# Altium project RP2040开发板.PrjPcb
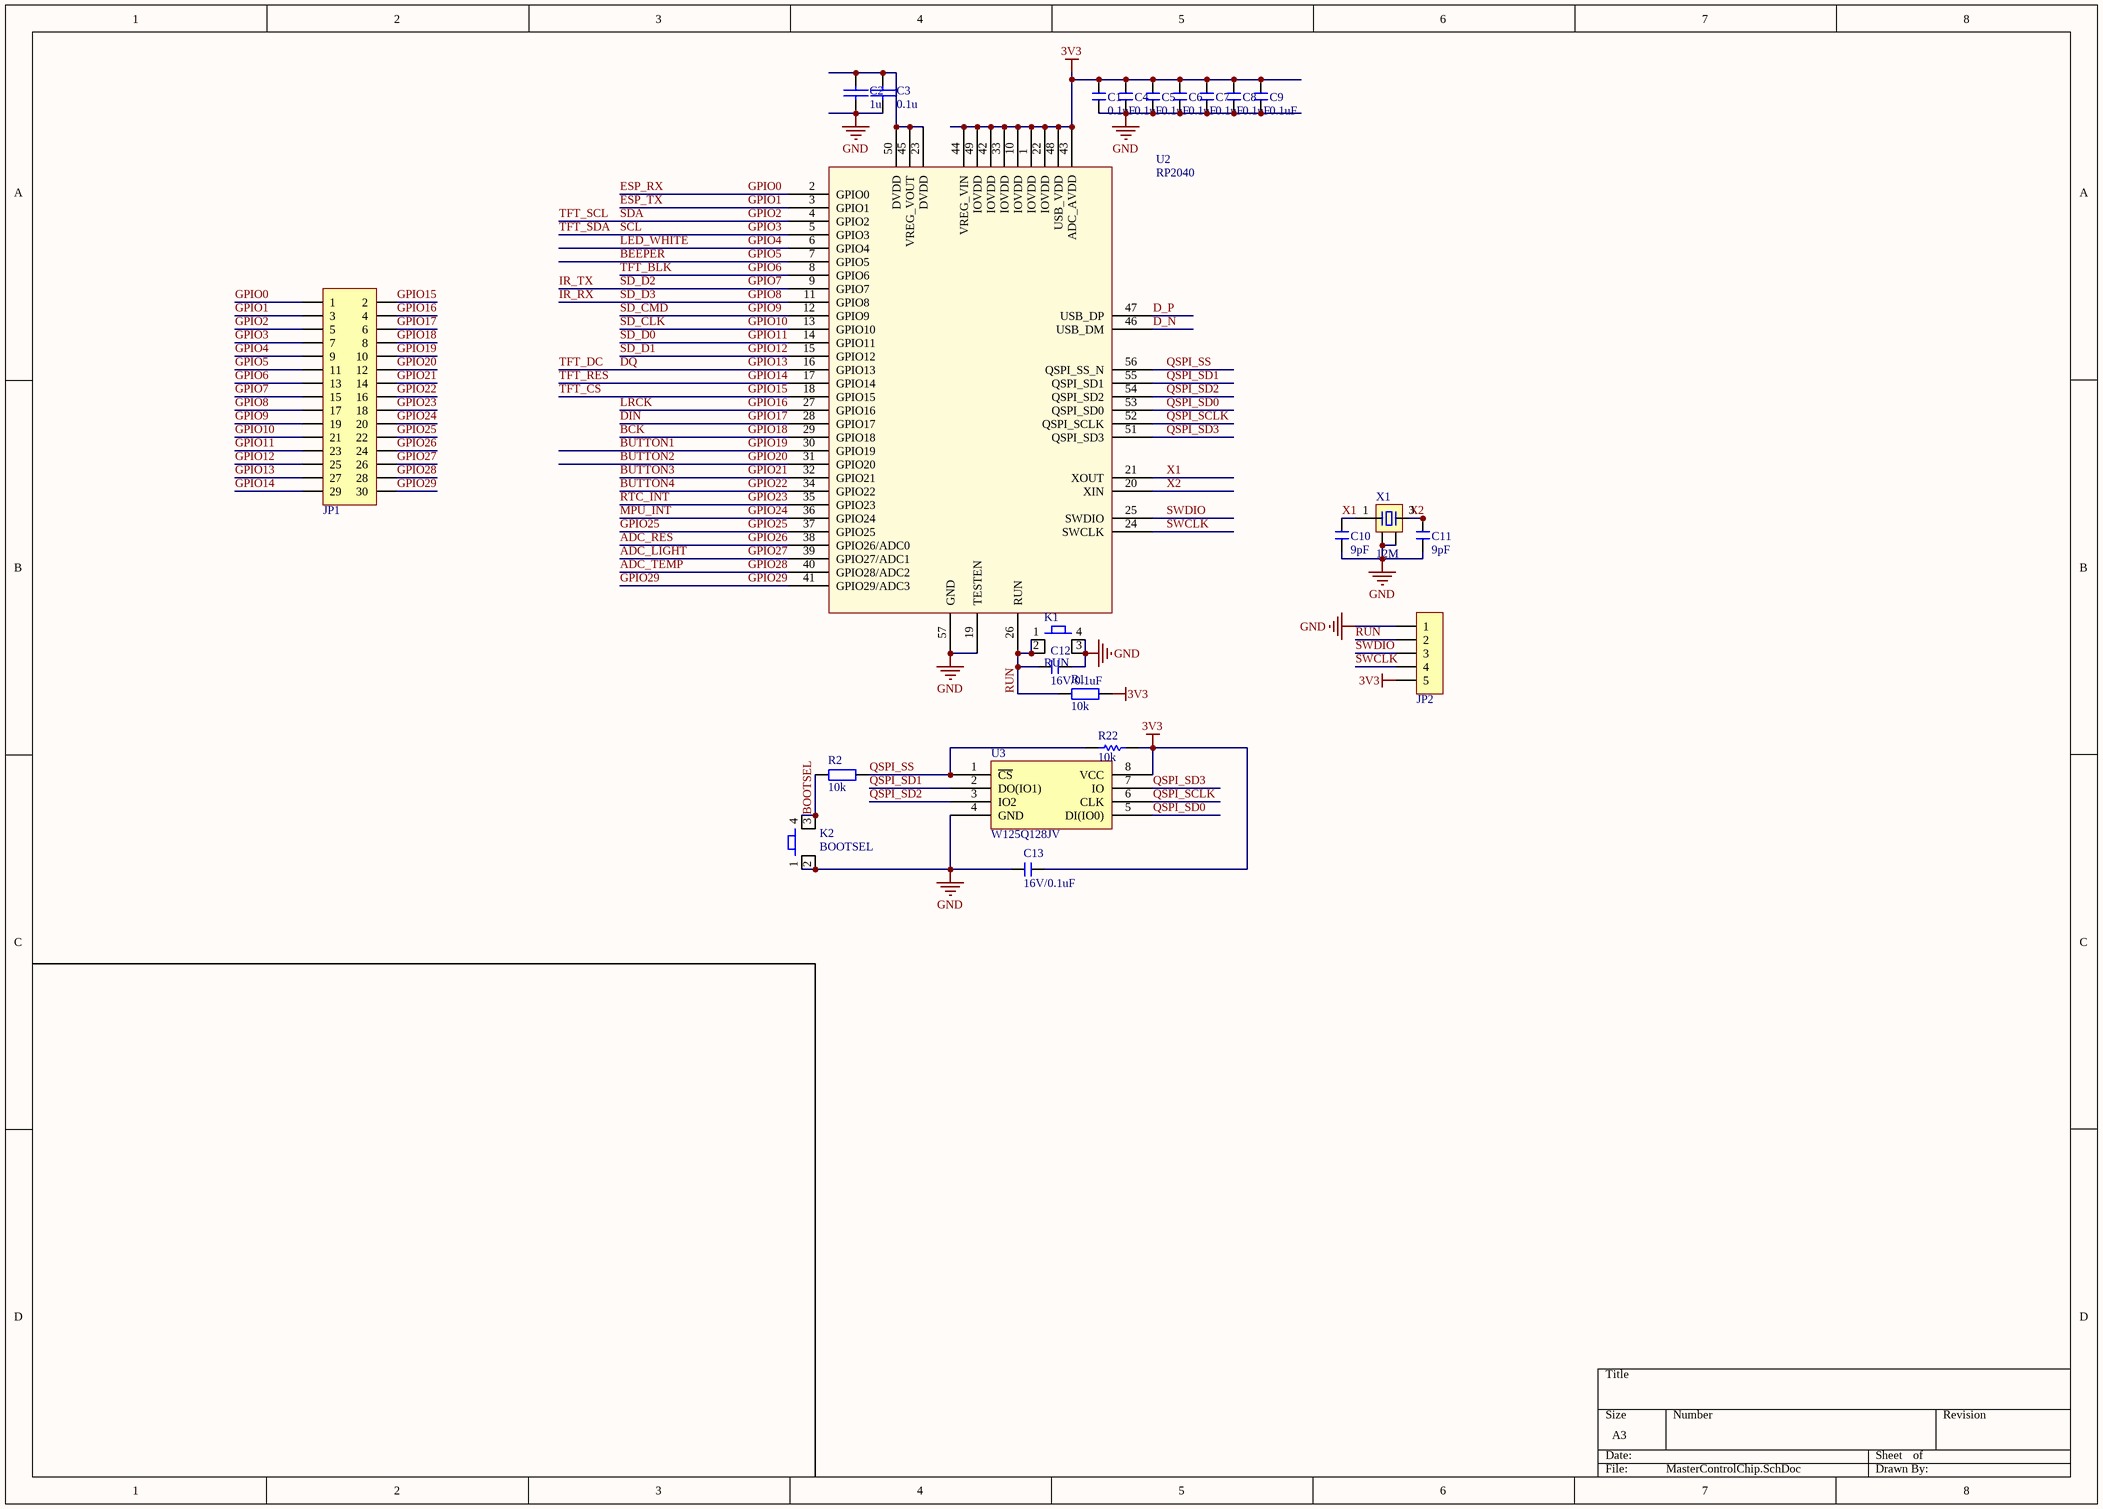
[diagram p0: MasterControlChip.SchDoc]
3 sheets, 139 parts. Net scope: global (net labels, ports and power ports of the same name join across sheets).
Board file: PCB2.PcbDoc
Sheets:
  MasterControlChip.SchDoc
  PowerManager.SchDoc
  Peripheral.SchDoc

## Sheet MasterControlChip.SchDoc
size A3

### Parts
C1  0.1uF  [C 0603_L]
C2  1u  [C 0603_L]
C3  0.1u  [C 0603_L]
C4  0.1uF  [C 0603_L]
C5  0.1uF  [C 0603_L]
C6  0.1uF  [C 0603_L]
C7  0.1uF  [C 0603_L]
C8  0.1uF  [C 0603_L]
C9  0.1uF  [C 0603_L]
C10  9pF  [C 0603_L]
C11  9pF  [C 0603_L]
C12  16V/0.1uF  [C 0603_L]
C13  16V/0.1uF  [C 0603_L]
JP1  Header 2X11  [HDR2.54-LI-2x15P]  (value not drawn)
JP2  HDR-1X5  [HDR2.54-M-LI-5P]  (value not drawn)
K1  RUN  [四角贴片开关]
K2  BOOTSEL  [四角贴片开关]
R1  10k  [R 0603_L]
R2  10k  [R 0603_L]
R22  10k  [0603R]
U2  RP2040  [QFN-56]
U3  W125Q128JV  [SOIC-8-208mil]
X1  12M  [OSC 3225-4P]

### Nets
3V3: C1.2 C4.2 C5.2 C6.2 C7.2 C8.2 C9.2 C13.1 JP2.5 R1.1 R22.2 U2.1(IOVDD) U2.10(IOVDD) U2.22(IOVDD) U2.33(IOVDD) U2.42(IOVDD) U2.43(ADC_AVDD) U2.44(VREG_VIN) U2.48(USB_VDD) U2.49(IOVDD) U3.8(VCC)
GND: C1.1 C2.1 C3.1 C4.1 C5.1 C6.1 C7.1 C8.1 C9.1 C10.1 C11.1 C12.1 C13.2 JP2.1 K1.3 K1.4 K2.1 K2.2 U2.19(TESTEN) U2.57(GND) U3.4(GND) X1.2 X1.4
ADC_LIGHT: JP1.26 U2.39(GPIO27/ADC1)  [also labelled GPIO27]
ADC_RES: JP1.24 U2.38(GPIO26/ADC0)  [also labelled GPIO26]
ADC_TEMP: JP1.28 U2.40(GPIO28/ADC2)  [also labelled GPIO28]
BCK: JP1.8 U2.29(GPIO18)  [also labelled GPIO18]
BEEPER: JP1.11 U2.7(GPIO5)  [also labelled GPIO5]
BOOTSEL: K2.3 K2.4 R2.2
BUTTON1: JP1.10 U2.30(GPIO19)  [also labelled GPIO19]
BUTTON2: JP1.12 U2.31(GPIO20)  [also labelled GPIO20]
BUTTON3: JP1.14 U2.32(GPIO21)  [also labelled GPIO21]
BUTTON4: JP1.16 U2.34(GPIO22)  [also labelled GPIO22]
D_N: U2.46(USB_DM)
D_P: U2.47(USB_DP)
DIN: JP1.6 U2.28(GPIO17)  [also labelled GPIO17]
DQ: JP1.27 U2.16(GPIO13)  [also labelled GPIO13, TFT_DC]
ESP_RX: JP1.1 U2.2(GPIO0)  [also labelled GPIO0]
ESP_TX: JP1.3 U2.3(GPIO1)  [also labelled GPIO1]
GPIO2: JP1.5 U2.4(GPIO2)  [also labelled SDA, TFT_SCL]
GPIO3: JP1.7 U2.5(GPIO3)  [also labelled SCL, TFT_SDA]
GPIO4: JP1.9 U2.6(GPIO4)  [also labelled LED_WHITE]
GPIO6: JP1.13 U2.8(GPIO6)  [also labelled TFT_BLK]
GPIO7: JP1.15 U2.9(GPIO7)  [also labelled IR_TX, SD_D2]
GPIO8: JP1.17 U2.11(GPIO8)  [also labelled IR_RX, SD_D3]
GPIO9: JP1.19 U2.12(GPIO9)  [also labelled SD_CMD]
GPIO10: JP1.21 U2.13(GPIO10)  [also labelled SD_CLK]
GPIO11: JP1.23 U2.14(GPIO11)  [also labelled SD_D0]
GPIO12: JP1.25 U2.15(GPIO12)  [also labelled SD_D1]
GPIO14: JP1.29 U2.17(GPIO14)  [also labelled TFT_RES]
GPIO15: JP1.2 U2.18(GPIO15)  [also labelled TFT_CS]
GPIO16: JP1.4 U2.27(GPIO16)  [also labelled LRCK]
GPIO23: JP1.18 U2.35(GPIO23)  [also labelled RTC_INT]
GPIO24: JP1.20 U2.36(GPIO24)  [also labelled MPU_INT]
GPIO25: JP1.22 U2.37(GPIO25)
GPIO29: JP1.30 U2.41(GPIO29/ADC3)
QSPI_SCLK: U2.52(QSPI_SCLK) U3.6(CLK)
QSPI_SD0: U2.53(QSPI_SD0) U3.5(DI(IO0))
QSPI_SD1: U2.55(QSPI_SD1) U3.2(DO(IO1))
QSPI_SD2: U2.54(QSPI_SD2) U3.3(IO2)
QSPI_SD3: U2.51(QSPI_SD3) U3.7(IO)
QSPI_SS: R2.1 R22.1 U2.56(QSPI_SS_N) U3.1(~{CS})
RUN: C12.2 JP2.2 K1.1 K1.2 R1.2 U2.26(RUN)
SWCLK: JP2.4 U2.24(SWCLK)
SWDIO: JP2.3 U2.25(SWDIO)
X1: C10.2 U2.21(XOUT) X1.1
X2: C11.2 U2.20(XIN) X1.3
NetC2_2: C2.2 C3.2 U2.23(DVDD) U2.45(VREG_VOUT) U2.50(DVDD)

### Library data of the parts
C1 C4-C13 = C: 无极性贴片电容; 版权归属: 源创客; 材质: X7R; BOM名称: 无极性贴片电容; 学习资源: www.ooocke.com
C2 = CAP: 靠近RP2040
C3 = CAP: 无极性电容
JP1 = Header 15X2: 15*2P接插件; 版权归属: 源创客; BOM名称: 15*2P接插件; 学习资源: www.ooocke.com
JP2 = Header 5: 5P接插件; 版权归属: 源创客; BOM名称: 5P接插件; 学习资源: www.ooocke.com
K1 K2 = 四角轻触开关
R1 R2 = R: 贴片电阻; 版权归属: 源创客; BOM名称: 贴片电阻; 学习资源: www.ooocke.com
R22 = RES
X1 = XTAL-4P: 4脚无源晶振

## Sheet PowerManager.SchDoc
size A4
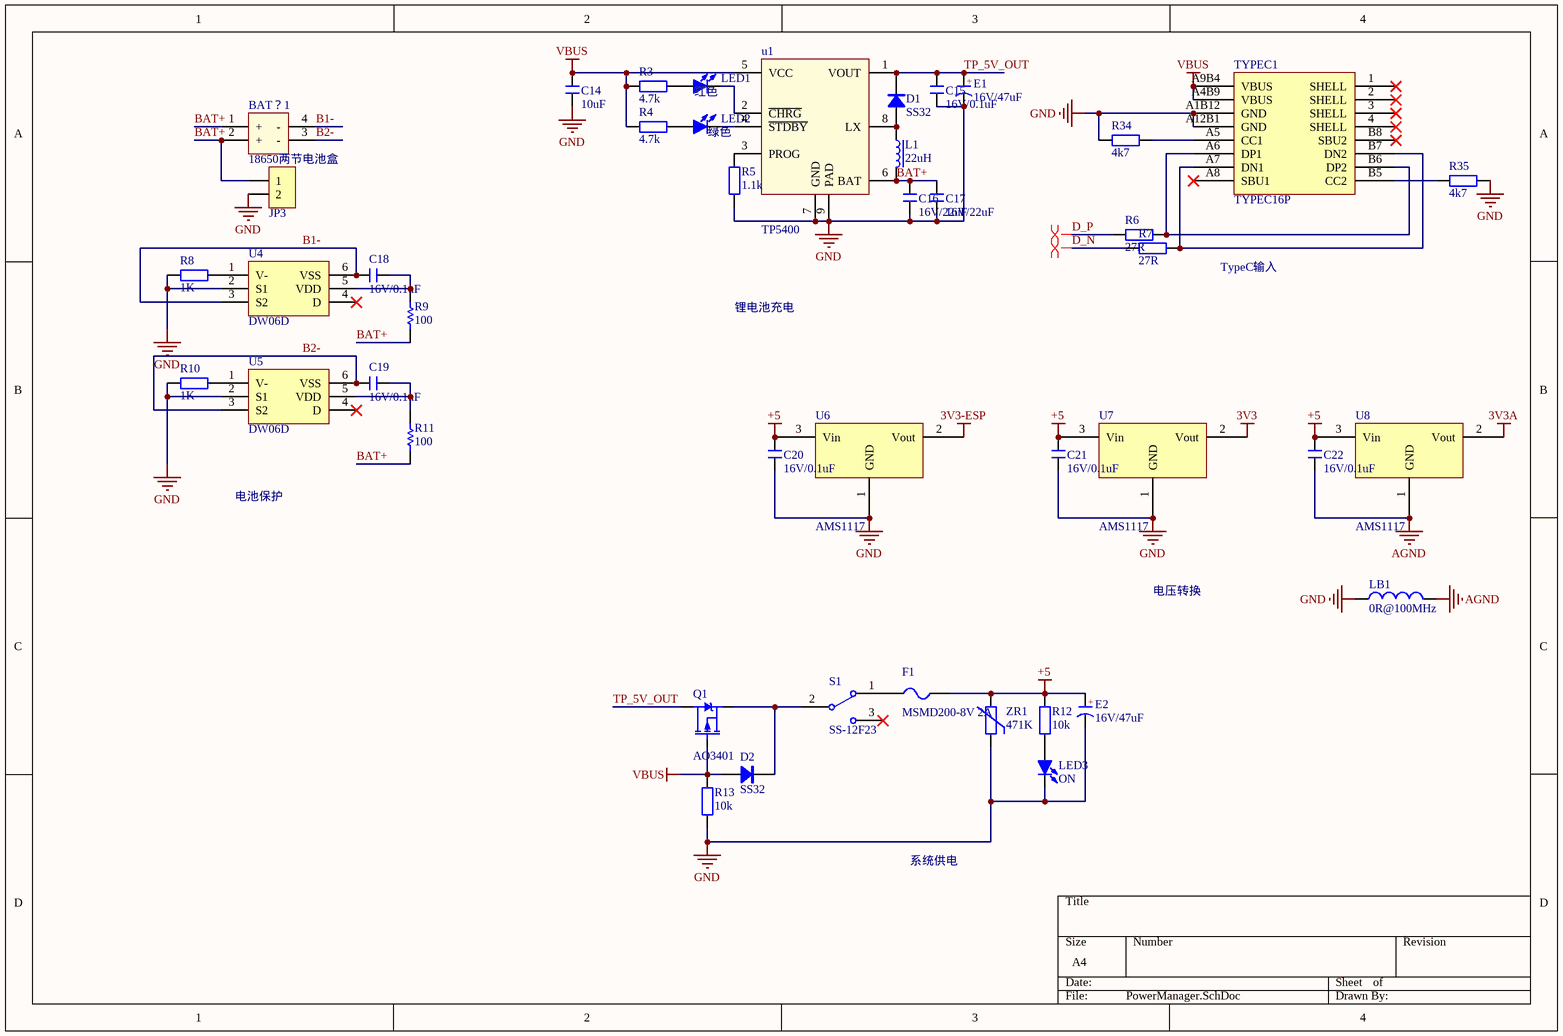
[diagram p1: PowerManager.SchDoc]

### Parts
BAT？1  18650两节电池盒  [18650两节电池盒]
C14  10uF  [C 0603_L]
C15  16V/0.1uF  [C 1206_L]
C16  16V/22uF  [C 1206_L]
C17  16V/22uF  [C 1206_L]
C18  16V/0.1uF  [C 1206_L]
C19  16V/0.1uF  [C 1206_L]
C20  16V/0.1uF  [C 1206_L]
C21  16V/0.1uF  [C 1206_L]
C22  16V/0.1uF  [C 1206_L]
D1  SS32  [SMA]
D2  SS32  [SMA]
E1  16V/47uF  [CM C(5*5.4)]
E2  16V/47uF  [CM C(5*5.4)]
F1  MSMD200-8V 2A  [FU 1206]
JP3  HDR-1X2  [XH2.54-WS-2P]  (value not drawn)
L1  22uH  [NR4020]
LB1  0R@100MHz  [FB 1206_L]
LED1  红色  [LED 0603R]
LED2  绿色  [LED 0603G]
LED3  ON  [LED 0603R]
Q1  AO3401  [SOT23]
R3  4.7k  [R 0603_L]
R4  4.7k  [R 0603_L]
R5  1.1k  [R 0603_L]
R6  27R  [R 0603_L]
R7  27R  [R 0603_L]
R8  1K  [R 0603_L]
R9  100  [0603R]
R10  1K  [R 0603_L]
R11  100  [0603R]
R12  10k  [R 0603_L]
R13  10k  [R 0603_L]
R34  4k7  [R 0603_L]
R35  4k7  [R 0603_L]
S1  SS-12F23  [SK-12D07VG3]
TYPEC1  TYPEC16P  [TYPEC-16P]
u1  TP5400  [ESOP8]
U4  DW06D  [SOT23-6]
U5  DW06D  [SOT23-6]
U6  AMS1117  [SOT89]
U7  AMS1117  [SOT89]
U8  AMS1117  [SOT89]
ZR1  471K  [R 0603_L]

### Nets
3V3: U7.2(Vout)
3V3-ESP: U6.2(Vout)
3V3A: U8.2(Vout)
+5: C20.2 C21.2 C22.2 E2.1(A) F1.2 R12.2 U6.3(Vin) U7.3(Vin) U8.3(Vin) ZR1.2
AGND: C22.1 LB1.2 U8.1(GND)
GND: C14.1 C15.1 C16.1 C17.1 C20.1 C21.1 E1.2(K) E2.2(K) JP3.2 LB1.1 LED3.2(K) R5.1 R8.1 R10.1 R13.1 R34.1 R35.1 TYPEC1.A1B12(GND) TYPEC1.A12B1(GND) u1.7(GND) u1.9(PAD) U4.2(S1) U5.2(S1) U6.1(GND) U7.1(GND) ZR1.1
VBUS: C14.2 D2.1(A) Q1.G R3.2 R4.2 R13.2 TYPEC1.A4B9(VBUS) TYPEC1.A9B4(VBUS) u1.5(VCC)
B1-: BAT？1.4(-) C18.2 U4.3(S2) U4.6(VSS)
B2-: BAT？1.3(-) C19.2 U5.3(S2) U5.6(VSS)
BAT+: BAT？1.1(+) BAT？1.2(+) C16.2 C17.2 JP3.1 L1.2 R9.2 R11.2 u1.6(BAT)
D_N: R7.1
D_P: R6.1
TP_5V_OUT: C15.2 D1.2(K) E1.1(A) Q1.D u1.1(VOUT)
NetC18_1: C18.1 R9.1 U4.5(VDD)
NetC19_1: C19.1 R11.1 U5.5(VDD)
NetD1_1: D1.1(A) L1.1 u1.8(LX)
NetD2_2: D2.2(K) Q1.S S1.2
NetF1_1: F1.1 S1.1
NetLED1_1: LED1.1(A) R3.1
NetLED1_2: LED1.2(K) u1.2(~{CHRG})
NetLED2_1: LED2.1(A) R4.1
NetLED2_2: LED2.2(K) u1.4(~{STDBY})
NetLED3_1: LED3.1(A) R12.1
NetR5_2: R5.2 u1.3(PROG)
NetR6_2: R6.2 TYPEC1.A6(DP1) TYPEC1.B6(DP2)
NetR7_2: R7.2 TYPEC1.A7(DN1) TYPEC1.B7(DN2)
NetR8_2: R8.2 U4.1(V-)
NetR10_2: R10.2 U5.1(V-)
NetR34_2: R34.2 TYPEC1.A5(CC1)
NetR35_2: R35.2 TYPEC1.B5(CC2)

Not connected (* = marked no-connect by the designer): S1 3*; TYPEC1 1(SHELL)* 2(SHELL)* 3(SHELL)* 4(SHELL)* A8(SBU1)* B8(SBU2)*; U4 4(D)*; U5 4(D)*

### Layout directives
differential pair: D_N, D_P

### Notes on the sheet
- 锂电池充电
- TypeC输入
- 电池保护
- 电压转换
- 系统供电
- (in symbol C-CM) +

### Library data of the parts
C14-C22 = C: 无极性贴片电容; 版权归属: 源创客; 材质: X7R; BOM名称: 无极性贴片电容; 学习资源: www.ooocke.com
D1 D2 = SS210: 肖特基二极管; 版权归属: 源创客; BOM名称: 肖特基二极管; 学习资源: www.ooocke.com
E1 E2 = C-CM: 贴片电解电容; 版权归属: 源创客; BOM名称: 贴片电解电容; 学习资源: www.ooocke.com
F1 = FU: 贴片保险丝; 版权归属: 源创客; BOM名称: 贴片保险丝; 学习资源: www.ooocke.com
JP3 = Header 2: 2P接插件; 版权归属: 源创客; BOM名称: 2P接插件; 学习资源: www.ooocke.com
L1 = L-NR: NR磁胶电感; 版权归属: 源创客; BOM名称: NR磁胶电感; 学习资源: www.ooocke.com
LB1 = LB: 磁珠; 版权归属: 源创客; BOM名称: 磁珠; 学习资源: www.ooocke.com
LED1-LED3 = LED-SMD: 贴片LED; 版权归属: 源创客; BOM名称: 贴片LED; 学习资源: www.ooocke.com
Q1 = P-MOS: P沟道场效应管
R3-R8 R10 R12 R13 R34 R35 = R: 贴片电阻; 版权归属: 源创客; BOM名称: 贴片电阻; 学习资源: www.ooocke.com
R9 R11 = RES
S1 = SSW-1P: 1路波动开关; BOM名称: 波动开关; 版权归属: 源创客; 学习资源: www.ooocke.com
U6-U8 = AMS1117: 三端稳压芯片
ZR1 = R_VDR: 压敏电阻; 版权归属: 源创客; BOM名称: 压敏电阻; 学习资源: www.ooocke.com

## Sheet Peripheral.SchDoc
size A3
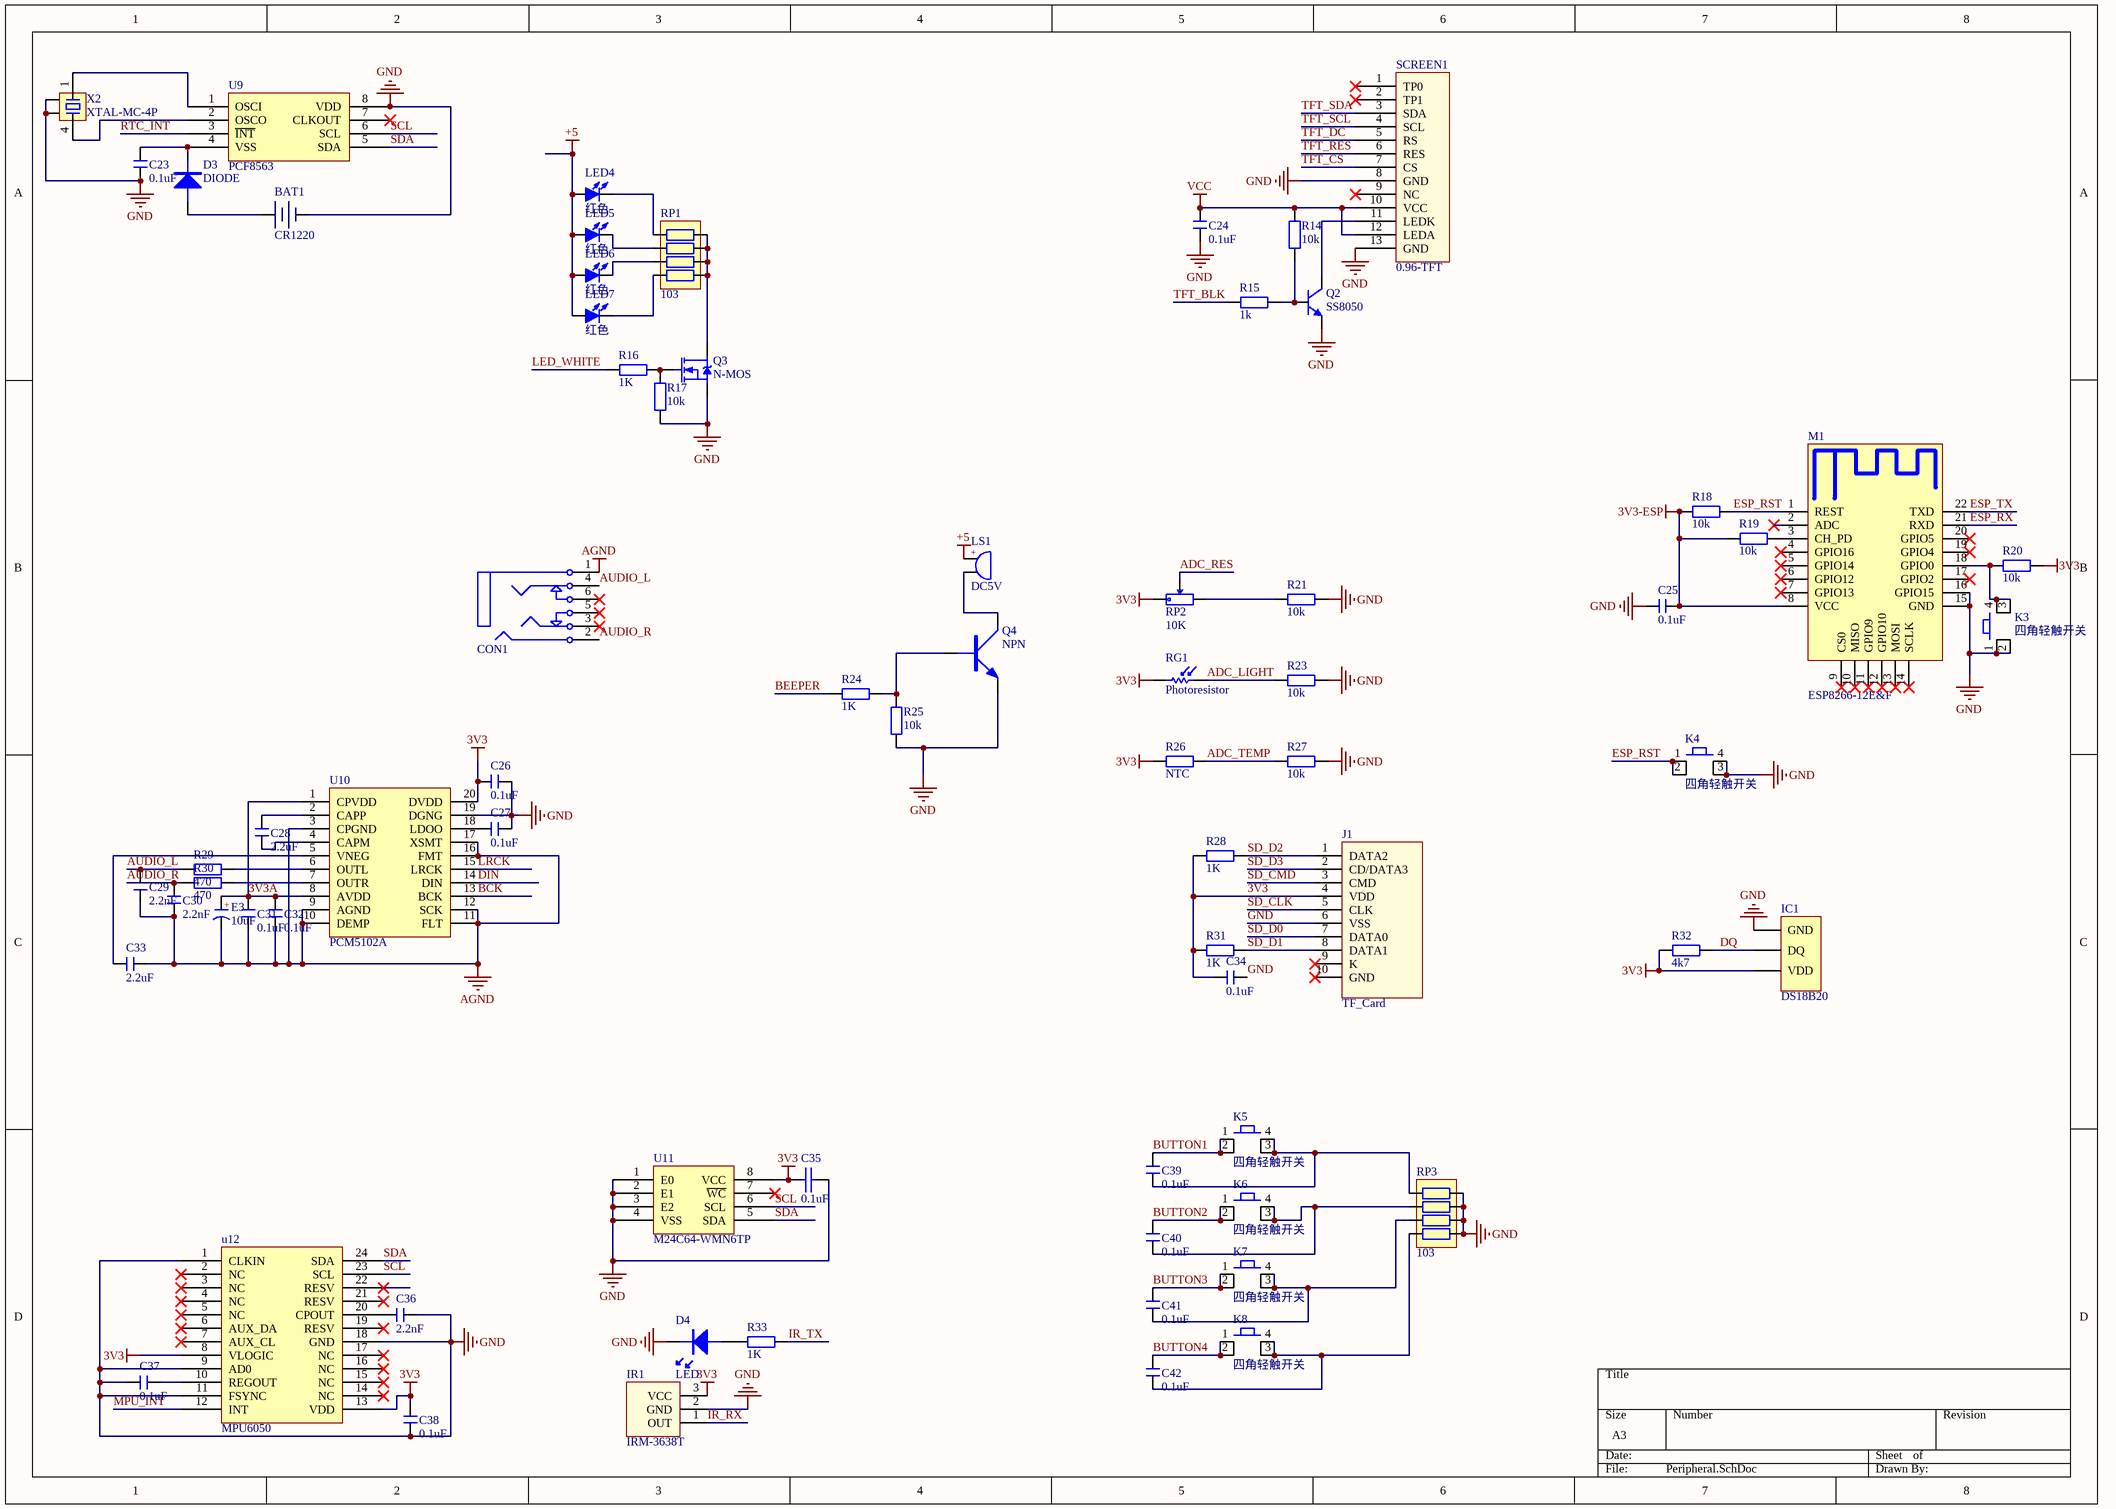
[diagram p2: Peripheral.SchDoc]

### Parts
BAT1  CR1220  [CR1220-A]
C23  0.1uF  [C 0603_L]
C24  0.1uF  [C 1206_L]
C25  0.1uF  [C 1206_L]
C26  0.1uF  [C 0603_L]
C27  0.1uF  [C 0603_L]
C28  2.2uF  [C 0603_L]
C29  2.2nF  [C 0603_L]
C30  2.2nF  [C 0603_L]
C31  0.1uF  [C 1206_L]
C32  0.1uF  [C 1206_L]
C33  2.2uF  [C 0603_L]
C34  0.1uF  [C 0603_L]
C35  0.1uF  [C 1206_L]
C36  2.2nF  [C 0603_L]
C37  0.1uF  [C 1206_L]
C38  0.1uF  [C 0603_L]
C39  0.1uF  [C 1206_L]
C40  0.1uF  [C 1206_L]
C41  0.1uF  [C 1206_L]
C42  0.1uF  [C 1206_L]
CON1  PJ342  [PJ342A]  (value not drawn)
D3  DIODE  [SOD-123]
D4  LED  [LED3-RED]
E3  10uF  [CM C(5*5.4)]
IC1  DS18B20  [TO92A]
IR1  IRM-3638T  [IRM-3638T]
J1  TF_Card  [Micro SD]
K3  四角轻触开关  [四角贴片开关]
K4  四角轻触开关  [四角贴片开关]
K5  四角轻触开关  [四角贴片开关]
K6  四角轻触开关  [四角贴片开关]
K7  四角轻触开关  [四角贴片开关]
K8  四角轻触开关  [四角贴片开关]
LED4  红色  [LED 1206W]
LED5  红色  [LED 1206W]
LED6  红色  [LED 1206W]
LED7  红色  [LED 1206W]
LS1  DC5V  [BUZZER-7525]
M1  ESP8266-12E&F  [ESP_12]
Q2  SS8050  [SOT-23]
Q3  N-MOS  [SOT23]
Q4  NPN  [SOT-23]
R14  10k  [R 0603_L]
R15  1k  [R 0603_L]
R16  1K  [R 0603_L]
R17  10k  [R 0603_L]
R18  10k  [R 0603_L]
R19  10k  [R 0603_L]
R20  10k  [R 0603_L]
R21  10k  [R 0603_L]
R23  10k  [R 0603_L]
R24  1K  [R 0603_L]
R25  10k  [R 0603_L]
R26  NTC  [R 0603_L]
R27  10k  [R 0603_L]
R28  1K  [R 0603_L]
R29  470  [R 0603_L]
R30  470  [R 0603_L]
R31  1K  [R 0603_L]
R32  4k7  [R 0603_L]
R33  1K  [R 0603_L]
RG1  Photoresistor  [Photoresistor]
RP1  103  [RCA-8P4R-0603]
RP2  10K  [拨盘电位器]
RP3  103  [RCA-8P4R-0603]
SCREEN1  0.96-TFT  [0.96-TFT]
U9  PCF8563  [SOP127P600X175-8N]
U10  PCM5102A  [TSSOP20]
U11  M24C64-WMN6TP  [SOP8]
u12  MPU6050  [QFN24 4x4]
X2  XTAL-MC-4P  [OSC MC-306]

### Nets
3V3: C26.2 C34.2 C35.2 C38.2 IC1.3(VDD) IR1.3(VCC) J1.4(VDD) R20.2 R26.1 R28.1 R31.1 R32.1 RG1.1 RP2.1 U10.20(DVDD) U11.8(VCC) u12.8(VLOGIC) u12.13(VDD)
3V3-ESP: C25.1 M1.8(VCC) R18.1 R19.1
3V3A: C31.2 C32.2 E3.1(A) U10.1(CPVDD) U10.8(AVDD)
+5: LED4.1(A) LED5.1(A) LED6.1(A) LED7.1(A) LS1.1
AGND: C29.1 C30.1 C31.1 C32.1 C33.1 CON1.1 E3.2(K) U10.3(CPGND) U10.9(AGND) U10.10(DEMP) U10.11(FLT) U10.12(SCK) U10.16(FMT) U10.17(XSMT)
GND: BAT1.2 C23.2 C24.2 C25.2 C26.1 C27.1 C34.1 C35.1 C36.2 C37.1 C38.1 D4.K IC1.1(GND) IR1.2(GND) J1.6(VSS) K3.1 K3.2 K4.3 K4.4 M1.15(GND) M1.16(GPIO15) Q2.2(E) Q3.S Q4.E R17.1 R21.1 R23.1 R25.1 R27.1 RP3.5 RP3.6 RP3.7 RP3.8 SCREEN1.8(GND) SCREEN1.13(GND) U9.8(VDD) U10.19(DGNG) U11.1(E0) U11.2(E1) U11.3(E2) U11.4(VSS) u12.1(CLKIN) u12.9(AD0) u12.11(FSYNC) u12.18(GND) X2.2 X2.3
VCC: C24.1 R14.2 SCREEN1.10(VCC) SCREEN1.12(LEDA)
ADC_LIGHT: R23.2 RG1.2
ADC_RES: RP2.2
ADC_TEMP: R26.2 R27.2
AUDIO_L: C29.2 CON1.4 R29.1
AUDIO_R: C30.2 CON1.2 R30.1
BCK: U10.13(BCK)
BEEPER: R24.1
BUTTON1: C39.1 K5.1 K5.2
BUTTON2: C40.1 K6.1 K6.2
BUTTON3: C41.1 K7.1 K7.2
BUTTON4: C42.1 K8.1 K8.2
DIN: U10.14(DIN)
DQ: IC1.2(DQ) R32.2 SCREEN1.5(RS)  [also labelled TFT_DC]
ESP_RST: K4.1 K4.2 M1.1(REST) R18.2
ESP_RX: M1.21(RXD)
ESP_TX: M1.22(TXD)
IR_RX: IR1.1(OUT) J1.2(CD/DATA3)  [also labelled SD_D3]  [project net GPIO8]
IR_TX: J1.1(DATA2) R28.2 R33.2  [also labelled SD_D2]  [project net GPIO7]
LED_WHITE: R16.1  [project net GPIO4]
LRCK: U10.15(LRCK)  [project net GPIO16]
MPU_INT: u12.12(INT)  [project net GPIO24]
RTC_INT: U9.3(~{INT})  [project net GPIO23]
SCL: SCREEN1.3(SDA) U9.6(SCL) U11.6(SCL) u12.23(SCL)  [also labelled TFT_SDA]  [project net GPIO3]
SD_CLK: J1.5(CLK)  [project net GPIO10]
SD_CMD: J1.3(CMD)  [project net GPIO9]
SD_D0: J1.7(DATA0)  [project net GPIO11]
SD_D1: J1.8(DATA1) R31.2  [project net GPIO12]
SDA: SCREEN1.4(SCL) U9.5(SDA) U11.5(SDA) u12.24(SDA)  [also labelled TFT_SCL]  [project net GPIO2]
TFT_BLK: R15.2  [project net GPIO6]
TFT_CS: SCREEN1.7(CS)  [project net GPIO15]
TFT_RES: SCREEN1.6(RES)  [project net GPIO14]
NetBAT1_1: BAT1.1 D3.A
NetC23_1: C23.1 D3.K U9.4(VSS)
NetC27_2: C27.2 U10.18(LDOO)
NetC28_1: C28.1 U10.2(CAPP)
NetC28_2: C28.2 U10.4(CAPM)
NetC33_2: C33.2 U10.5(VNEG)
NetC36_1: C36.1 u12.20(CPOUT)
NetC37_2: C37.2 u12.10(REGOUT)
NetC39_2: C39.2 K5.3 K5.4 RP3.1
NetC40_2: C40.2 K6.3 K6.4 RP3.2
NetC41_2: C41.2 K7.3 K7.4 RP3.3
NetC42_2: C42.2 K8.3 K8.4 RP3.4
NetD4_A: D4.A R33.1
NetK3_3: K3.3 K3.4 M1.18(GPIO0) R20.1
NetLED4_2: LED4.2(K) RP1.1
NetLED5_2: LED5.2(K) RP1.2
NetLED6_2: LED6.2(K) RP1.3
NetLED7_2: LED7.2(K) RP1.4
NetLS1_2: LS1.2 Q4.C
NetM1_3: M1.3(CH_PD) R19.2
NetQ2_1: Q2.1(B) R14.1 R15.1
NetQ2_3: Q2.3(C) SCREEN1.11(LEDK)
NetQ3_D: Q3.D RP1.5 RP1.6 RP1.7 RP1.8
NetQ3_G: Q3.G R16.2 R17.2
NetQ4_B: Q4.B R24.2 R25.2
NetR21_2: R21.2 RP2.3
NetR29_2: R29.2 U10.6(OUTL)
NetR30_2: R30.2 U10.7(OUTR)
NetU9_1: U9.1(OSCI) X2.1
NetU9_2: U9.2(OSCO) X2.4

Not connected (* = marked no-connect by the designer): CON1 3* 5* 6*; J1 9(K)* 10(GND)*; M1 2(ADC)* 4(GPIO16)* 5(GPIO14)* 6(GPIO12)* 7(GPIO13)* 9(CS0)* 10(MISO)* 11(GPIO9)* 12(GPIO10)* 13(MOSI)* 14(SCLK)* 17(GPIO2)* 19(GPIO4)* 20(GPIO5)*; SCREEN1 1(TP0)* 2(TP1)* 9(NC)*; U9 7(CLKOUT)*; U11 7(~{WC})*; u12 2(NC)* 3(NC)* 4(NC)* 5(NC)* 6(AUX_DA)* 7(AUX_CL)* 14(NC)* 15(NC)* 16(NC)* 17(NC)* 19(RESV)* 21(RESV)* 22(RESV)*

### Notes on the sheet
- (in symbol BEEP) +
- (in symbol C-CM) +

### Library data of the parts
C23-C33 C39-C42 = C: 村田1206电容; BOM名称: 无极性贴片电容; 版权归属: 源创客; 材质: X7R; 学习资源: www.ooocke.com
C34 C36-C38 = C: 无极性贴片电容; 版权归属: 源创客; 材质: X7R; BOM名称: 无极性贴片电容; 学习资源: www.ooocke.com
C35 = CAP: 无极性电容
CON1 = PJ342: 3.5耳机插座,4Pin; BOM名称: 耳机插座; 版权归属: 源创客; 学习资源: www.ooocke.com
D3 = DIODE: 普通二极管
E3 = C-CM: 贴片电解电容; 版权归属: 源创客; BOM名称: 贴片电解电容; 学习资源: www.ooocke.com
IC1 = DS18B20: 数字温度计; 版权归属: 源创客; BOM名称: 数字温度计; 学习资源: www.ooocke.com
J1 = TF_Card: TF卡座; 版权归属: 源创客; BOM名称: TF卡座; 学习资源: www.ooocke.com
LED4-LED7 = LED-SMD: 贴片LED; 版权归属: 源创客; BOM名称: 贴片LED; 学习资源: www.ooocke.com
LS1 = BEEP: 蜂鸣器; 版权归属: 源创客; BOM名称: 蜂鸣器; 学习资源: www.ooocke.com
M1 = ESP8266-12: 串口 WIFI模块，ESP-12E&F; BOM名称: WIFI模块; 版权归属: 源创客; 学习资源: www.ooocke.com
Q2 = 8050-SMD: 高频放大-NPN型; 版权归属: 源创客; 属性: 40V 1.5A 1W 100MHZ; BOM名称: 高频放大-NPN型; 学习资源: www.ooocke.com
Q3 = N-MOS: N沟道场效应管
Q4 = NPN: NPN三极管
R14-R21 R23-R33 = R: 贴片电阻; 版权归属: 源创客; BOM名称: 贴片电阻; 学习资源: www.ooocke.com
RG1 = Photoresistor: 光敏电阻
RP1 RP3 = R-8P4R: 贴片网络排阻; 版权归属: 源创客; BOM名称: 贴片网络排阻; 学习资源: www.ooocke.com
RP2 = RP-SMD: 贴片电位器; 版权归属: 源创客; BOM名称: 贴片电位器; 学习资源: www.ooocke.com
X2 = XTAL-MC-4P: MC系列4脚晶振

## Nets that join several sheets
3V3: MasterControlChip (21 pins), PowerManager (U7.2), Peripheral (18 pins)
3V3-ESP: PowerManager (U6.2), Peripheral (C25.1 M1.8 R18.1 R19.1)
3V3A: PowerManager (U8.2), Peripheral (5 pins)
+5: PowerManager (10 pins), Peripheral (5 pins)
AGND: PowerManager (C22.1 LB1.2 U8.1), Peripheral (14 pins)
GND: MasterControlChip (23 pins), PowerManager (26 pins), Peripheral (47 pins)
ADC_LIGHT: MasterControlChip (JP1.26 U2.39), Peripheral (R23.2 RG1.2)
ADC_RES: MasterControlChip (JP1.24 U2.38), Peripheral (RP2.2)
ADC_TEMP: MasterControlChip (JP1.28 U2.40), Peripheral (R26.2 R27.2)
BCK: MasterControlChip (JP1.8 U2.29), Peripheral (U10.13)
BEEPER: MasterControlChip (JP1.11 U2.7), Peripheral (R24.1)
BUTTON1: MasterControlChip (JP1.10 U2.30), Peripheral (C39.1 K5.1 K5.2)
BUTTON2: MasterControlChip (JP1.12 U2.31), Peripheral (C40.1 K6.1 K6.2)
BUTTON3: MasterControlChip (JP1.14 U2.32), Peripheral (C41.1 K7.1 K7.2)
BUTTON4: MasterControlChip (JP1.16 U2.34), Peripheral (C42.1 K8.1 K8.2)
D_N: MasterControlChip (U2.46), PowerManager (R7.1)
D_P: MasterControlChip (U2.47), PowerManager (R6.1)
DIN: MasterControlChip (JP1.6 U2.28), Peripheral (U10.14)
DQ: MasterControlChip (JP1.27 U2.16), Peripheral (IC1.2 R32.2 SCREEN1.5)
ESP_RX: MasterControlChip (JP1.1 U2.2), Peripheral (M1.21)
ESP_TX: MasterControlChip (JP1.3 U2.3), Peripheral (M1.22)
GPIO2: MasterControlChip (JP1.5 U2.4), Peripheral (SCREEN1.4 U9.5 U11.5 u12.24)
GPIO3: MasterControlChip (JP1.7 U2.5), Peripheral (SCREEN1.3 U9.6 U11.6 u12.23)
GPIO4: MasterControlChip (JP1.9 U2.6), Peripheral (R16.1)
GPIO6: MasterControlChip (JP1.13 U2.8), Peripheral (R15.2)
GPIO7: MasterControlChip (JP1.15 U2.9), Peripheral (J1.1 R28.2 R33.2)
GPIO8: MasterControlChip (JP1.17 U2.11), Peripheral (IR1.1 J1.2)
GPIO9: MasterControlChip (JP1.19 U2.12), Peripheral (J1.3)
GPIO10: MasterControlChip (JP1.21 U2.13), Peripheral (J1.5)
GPIO11: MasterControlChip (JP1.23 U2.14), Peripheral (J1.7)
GPIO12: MasterControlChip (JP1.25 U2.15), Peripheral (J1.8 R31.2)
GPIO14: MasterControlChip (JP1.29 U2.17), Peripheral (SCREEN1.6)
GPIO15: MasterControlChip (JP1.2 U2.18), Peripheral (SCREEN1.7)
GPIO16: MasterControlChip (JP1.4 U2.27), Peripheral (U10.15)
GPIO23: MasterControlChip (JP1.18 U2.35), Peripheral (U9.3)
GPIO24: MasterControlChip (JP1.20 U2.36), Peripheral (u12.12)